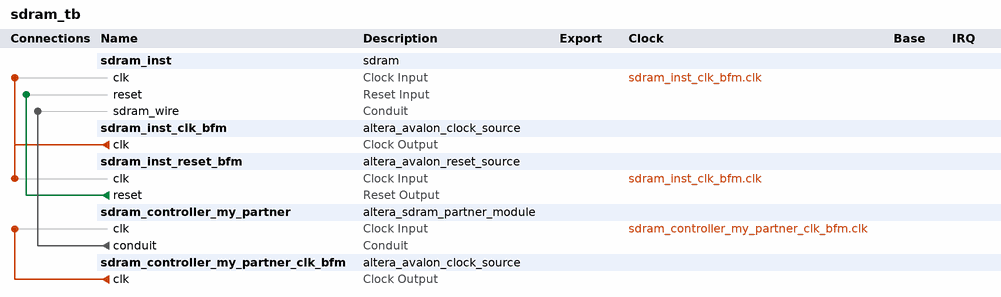
[diagram p0: system contents]
# Platform Designer (Qsys) system sdram_tb, Cyclone IV E EP4CE115F29C7
# Parameters at their usual value, and those the tool derives, are not listed.
package require -exact qsys 13.0
create_system sdram_tb
set_project_property DEVICE_FAMILY {Cyclone IV E}
set_project_property DEVICE EP4CE115F29C7

add_instance sdram_inst sdram 1.0
set_instance_parameter_value sdram_inst new_parameter_0 10

add_instance sdram_inst_clk_bfm altera_avalon_clock_source 13.0

add_instance sdram_inst_reset_bfm altera_avalon_reset_source 13.0
set_instance_parameter_value sdram_inst_reset_bfm ASSERT_HIGH_RESET 0
set_instance_parameter_value sdram_inst_reset_bfm INITIAL_RESET_CYCLES 50

add_instance sdram_controller_my_partner altera_sdram_partner_module 11.0
set_instance_parameter_value sdram_controller_my_partner SDRAM_DATA_WIDTH 32
set_instance_parameter_value sdram_controller_my_partner SDRAM_COL_WIDTH 10
set_instance_parameter_value sdram_controller_my_partner SDRAM_ROW_WIDTH 13
set_instance_parameter_value sdram_controller_my_partner CONTR_NAME sdram_sdram_controller

add_instance sdram_controller_my_partner_clk_bfm altera_avalon_clock_source 13.0

# connections
add_connection sdram_controller_my_partner_clk_bfm.clk sdram_controller_my_partner.clk clock
add_connection sdram_inst_clk_bfm.clk sdram_inst.clk clock
add_connection sdram_inst_clk_bfm.clk sdram_inst_reset_bfm.clk clock
add_connection sdram_inst_reset_bfm.reset sdram_inst.reset reset
add_connection sdram_controller_my_partner.conduit sdram_inst.sdram_wire conduit

set_interconnect_requirement {$system} qsys_mm.clockCrossingAdapter HANDSHAKE
set_interconnect_requirement {$system} qsys_mm.maxAdditionalLatency 1

save_system sdram_tb.qsys
